# Altium schematic sheet FPGA Bank 3.SchDoc
size A4
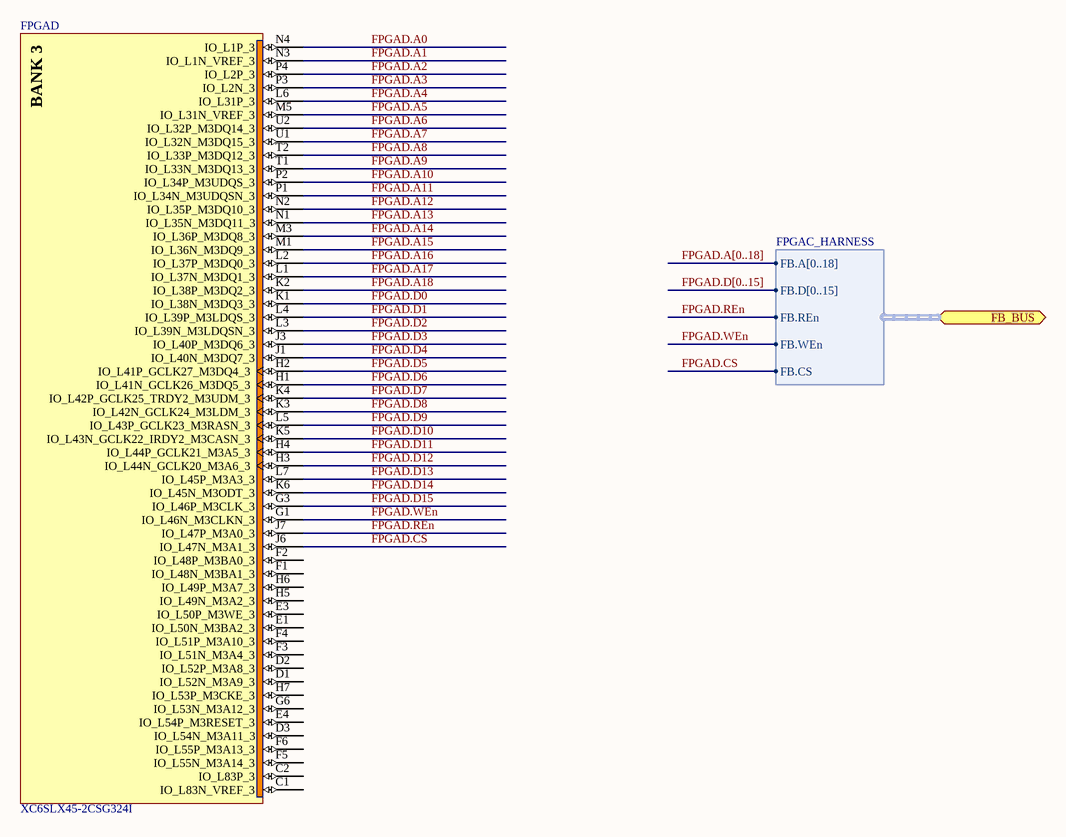
[diagram p0: FPGA Bank 3.SchDoc]

## Parts
FPGA  XC6SLX45-2CSG324I  [CSG324]  (part D of 8)

## Ports
FB_BUS (harness FPGAC_HARNESS)

## Harnesses
FPGAC_HARNESS: FB.A[0..18], FB.D[0..15], FB.REn, FB.WEn, FB.CS

## Nets
FPGAD.A0: FPGA.N4(IO_L1P_3)
FPGAD.A1: FPGA.N3(IO_L1N_VREF_3)
FPGAD.A2: FPGA.P4(IO_L2P_3)
FPGAD.A3: FPGA.P3(IO_L2N_3)
FPGAD.A4: FPGA.L6(IO_L31P_3)
FPGAD.A5: FPGA.M5(IO_L31N_VREF_3)
FPGAD.A6: FPGA.U2(IO_L32P_M3DQ14_3)
FPGAD.A7: FPGA.U1(IO_L32N_M3DQ15_3)
FPGAD.A8: FPGA.T2(IO_L33P_M3DQ12_3)
FPGAD.A9: FPGA.T1(IO_L33N_M3DQ13_3)
FPGAD.A10: FPGA.P2(IO_L34P_M3UDQS_3)
FPGAD.A11: FPGA.P1(IO_L34N_M3UDQSN_3)
FPGAD.A12: FPGA.N2(IO_L35P_M3DQ10_3)
FPGAD.A13: FPGA.N1(IO_L35N_M3DQ11_3)
FPGAD.A14: FPGA.M3(IO_L36P_M3DQ8_3)
FPGAD.A15: FPGA.M1(IO_L36N_M3DQ9_3)
FPGAD.A16: FPGA.L2(IO_L37P_M3DQ0_3)
FPGAD.A17: FPGA.L1(IO_L37N_M3DQ1_3)
FPGAD.A18: FPGA.K2(IO_L38P_M3DQ2_3)
FPGAD.CS: FPGA.J6(IO_L47N_M3A1_3) ; port FB_BUS.FB.CS
FPGAD.D0: FPGA.K1(IO_L38N_M3DQ3_3)
FPGAD.D1: FPGA.L4(IO_L39P_M3LDQS_3)
FPGAD.D2: FPGA.L3(IO_L39N_M3LDQSN_3)
FPGAD.D3: FPGA.J3(IO_L40P_M3DQ6_3)
FPGAD.D4: FPGA.J1(IO_L40N_M3DQ7_3)
FPGAD.D5: FPGA.H2(IO_L41P_GCLK27_M3DQ4_3)
FPGAD.D6: FPGA.H1(IO_L41N_GCLK26_M3DQ5_3)
FPGAD.D7: FPGA.K4(IO_L42P_GCLK25_TRDY2_M3UDM_3)
FPGAD.D8: FPGA.K3(IO_L42N_GCLK24_M3LDM_3)
FPGAD.D9: FPGA.L5(IO_L43P_GCLK23_M3RASN_3)
FPGAD.D10: FPGA.K5(IO_L43N_GCLK22_IRDY2_M3CASN_3)
FPGAD.D11: FPGA.H4(IO_L44P_GCLK21_M3A5_3)
FPGAD.D12: FPGA.H3(IO_L44N_GCLK20_M3A6_3)
FPGAD.D13: FPGA.L7(IO_L45P_M3A3_3)
FPGAD.D14: FPGA.K6(IO_L45N_M3ODT_3)
FPGAD.D15: FPGA.G3(IO_L46P_M3CLK_3)
FPGAD.REn: FPGA.J7(IO_L47P_M3A0_3) ; port FB_BUS.FB.REn
FPGAD.WEn: FPGA.G1(IO_L46N_M3CLKN_3) ; port FB_BUS.FB.WEn

Not connected (* = marked no-connect by the designer): FPGA C1(IO_L83N_VREF_3) C2(IO_L83P_3) D1(IO_L52N_M3A9_3) D2(IO_L52P_M3A8_3) D3(IO_L54N_M3A11_3) E1(IO_L50N_M3BA2_3) E3(IO_L50P_M3WE_3) E4(IO_L54P_M3RESET_3) F1(IO_L48N_M3BA1_3) F2(IO_L48P_M3BA0_3) F3(IO_L51N_M3A4_3) F4(IO_L51P_M3A10_3) F5(IO_L55N_M3A14_3) F6(IO_L55P_M3A13_3) G6(IO_L53N_M3A12_3) H5(IO_L49N_M3A2_3) H6(IO_L49P_M3A7_3) H7(IO_L53P_M3CKE_3)

## Buses and harness runs
bus FPGAD.A[0..18]
bus FPGAD.D[0..15]

## Notes on the sheet
- (in symbol XC6SLX45-2CSG324I, part D) BANK 3

## Library data of the parts
FPGA = XC6SLX45-2CSG324I: Spartan-6 LX 1.2V FPGA, 218 User I/Os, 324-Ball Chip-Scale BGA (0.8mm Pitch), Speed Grade 2, Industrial Grade, Pb-Free; Published: 17-Nov-2009; DatasheetVersion: ver1.6, Nov-2010; PackageVersion: ver1.1, Nov-2009; PackageReference: CSG324; Publisher: Altium Limited; PackageDescription: 324-Ball Chip-Scale BGA (CSG324) Package, 0.8 mm Pitch; Supplier 1: Digi-Key; Supplier Part Number 1: XC6SLX45-2CSG324I-ND; Code_JEDEC: MO-275-KKAC-1; ComponentLink1Description: Manufacturer Link; ComponentLink1URL: http://www.xilinx.com; ComponentLink2Description: Spartan-6 Datasheet; ComponentLink2URL: http://www.xilinx.com/support/documentation/data_sheets/ds160.pdf; ComponentLink3Description: Spartan-6 Documents; ComponentLink3URL: http://www.xilinx.com/support/documentation/spartan-6.htm; ComponentLink4Description: Xilinx.com Home; ComponentLink4URL: http://www.xilinx.com